# Altium schematic sheet 1_P1.schdoc.schdoc
size 431 x 309 mm; Symbol: Sheet-Symbol_A3; Device: Sheet-Symbol_A3; Company: EasyEDA.com; Drawed: Tejas Gulur; Reviewed: EasyEDA Pro; Version: V0.1; Page Size: A3; @Project Name: ESP32-Project; @Page Count: 1; @Update Date: 2023-02-14; @Create Date: 2022-12-23; @Schematic Name: ESP32-Project; Part Number: JLCPCB-001; @Page No: 1; @Page Name: P1
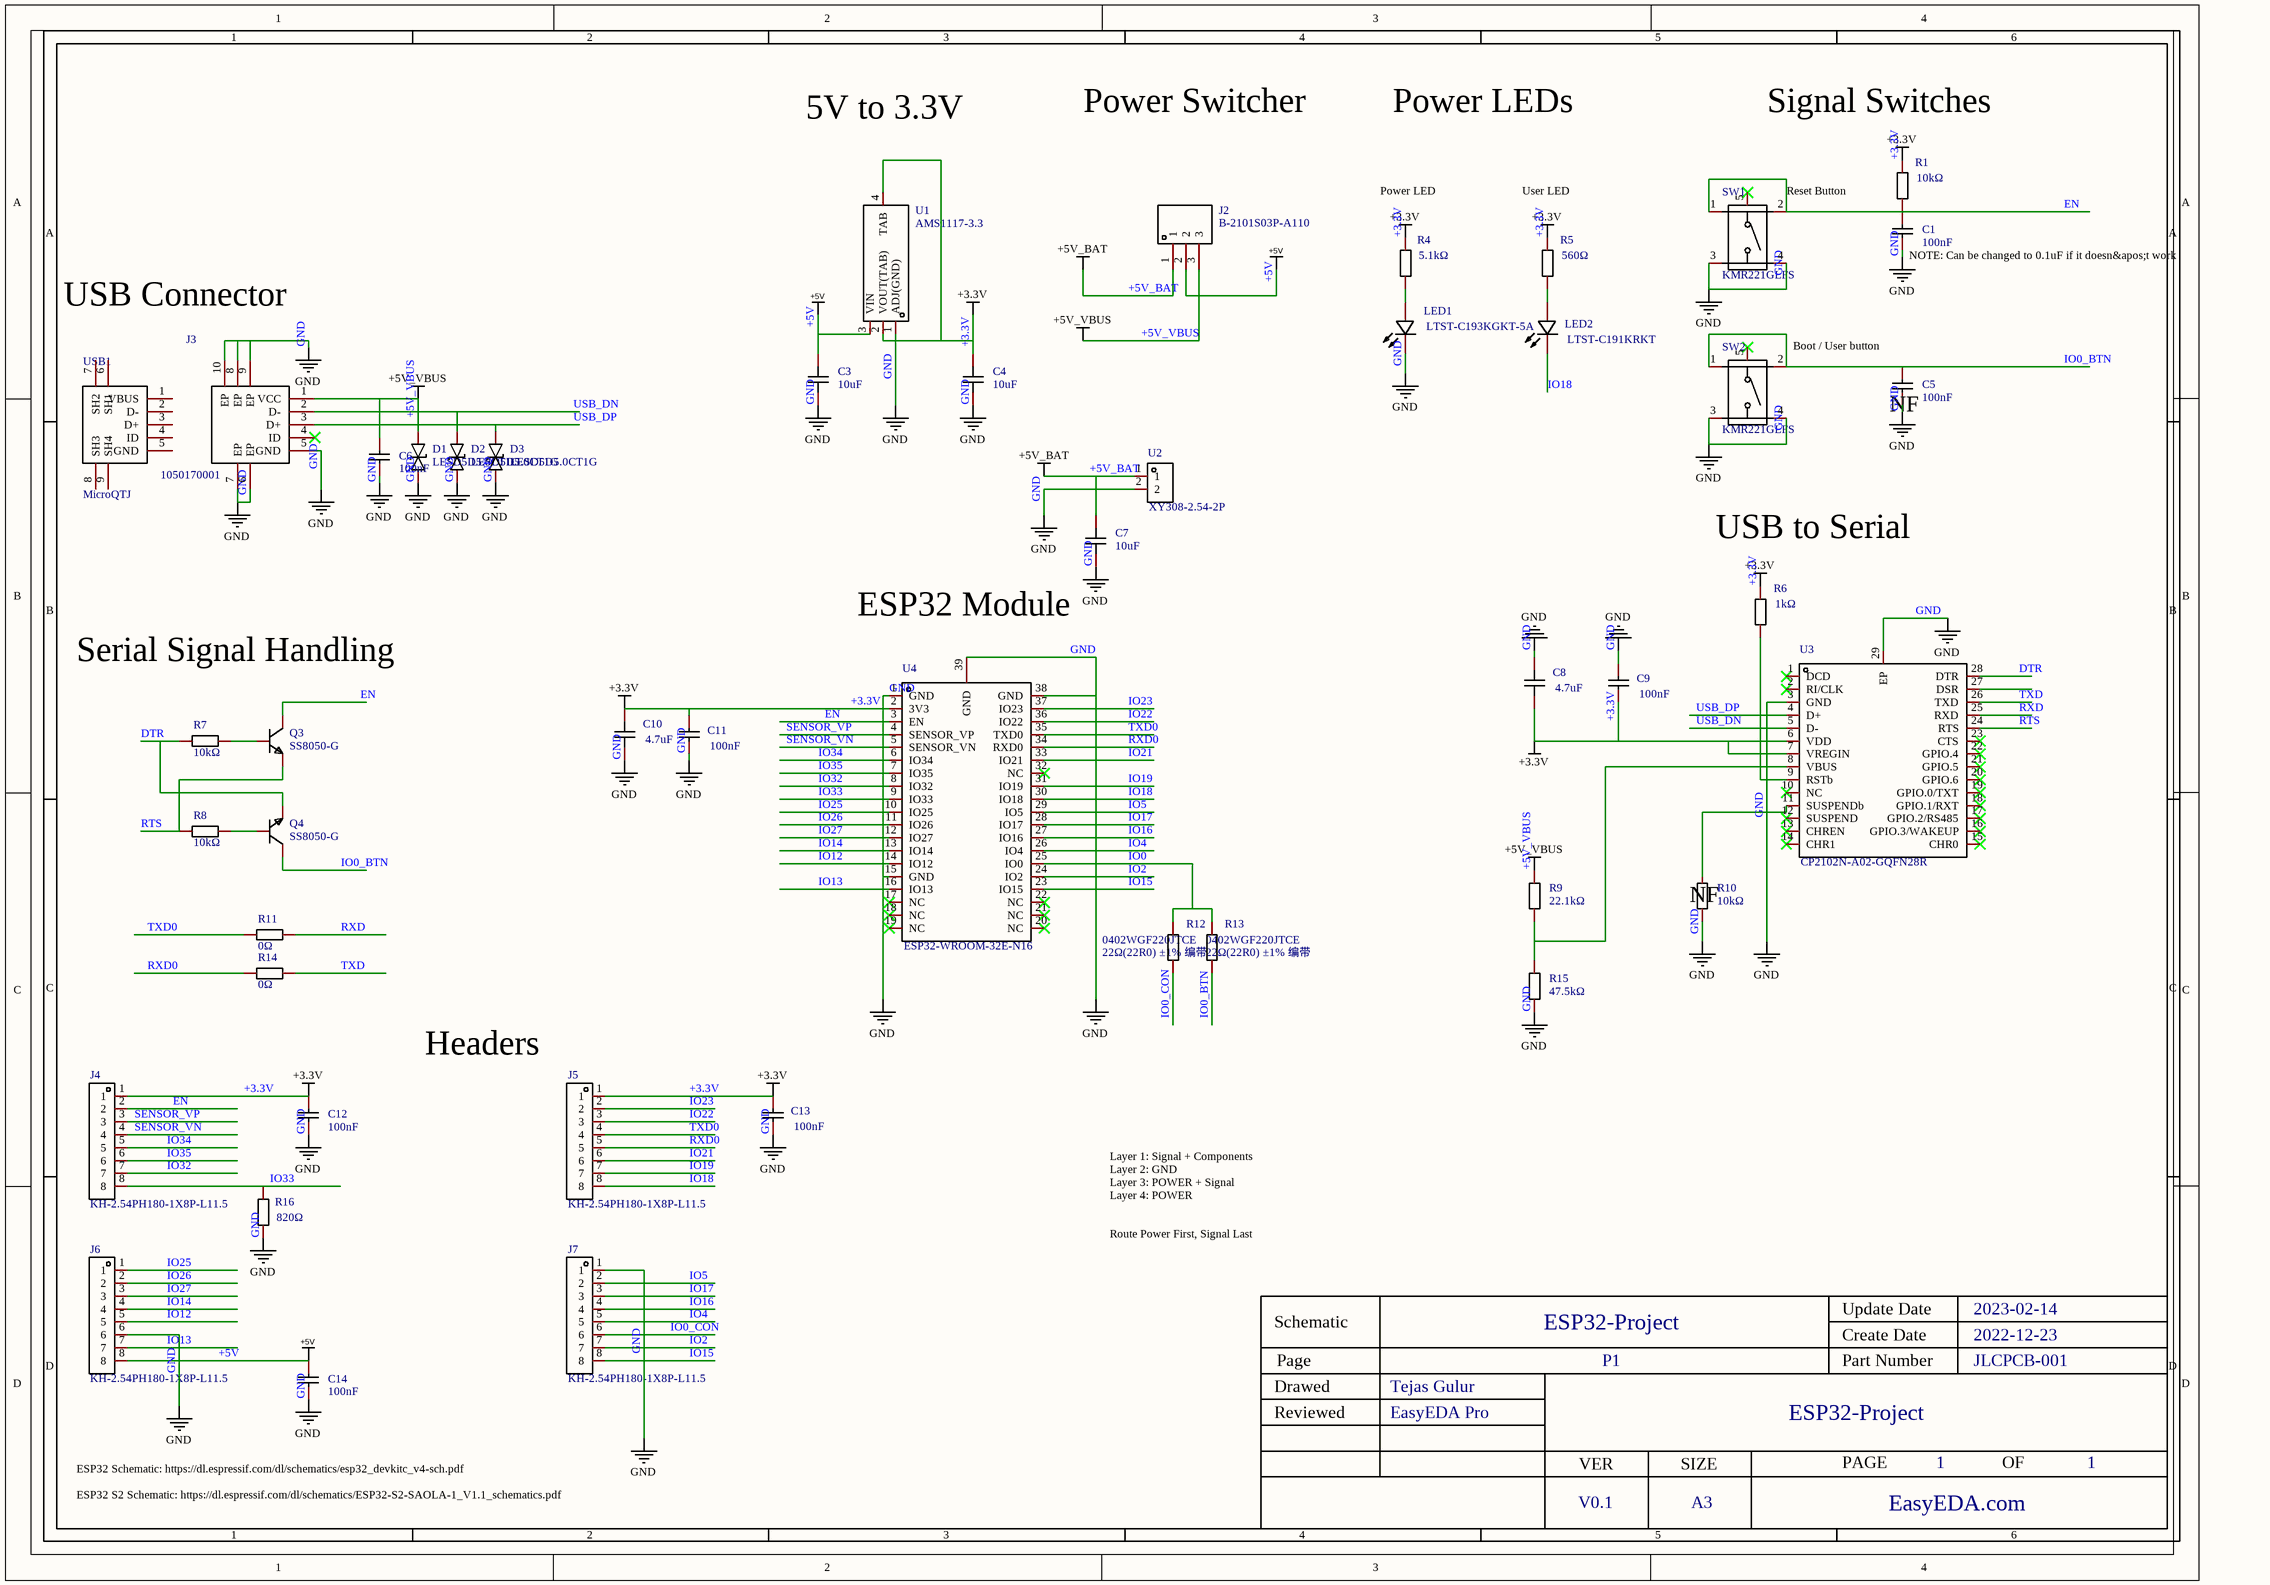
[diagram p0: 1_P1.schdoc.schdoc]

## Parts
C1  100nF  [C0402_NEW]
C3  10uF  [C0402]
C4  10uF  [C0402]
C5  100nF  [C0402_NEW]
C6  100nF  [C0402_NEW]
C7  10uF  [C0402]
C8  4.7uF  [C0402]
C9  100nF  [C0402_NEW]
C10  4.7uF  [C0402]
C11  100nF  [C0402_NEW]
C12  100nF  [C0402_NEW]
C13  100nF  [C0402_NEW]
C14  100nF  [C0402_NEW]
D1  LESD5D5.0CT1G  [SOD-523_L1.2-W0.8-LS1.6-BI]
D2  LESD5D5.0CT1G  [SOD-523_L1.2-W0.8-LS1.6-BI]
D3  LESD5D5.0CT1G  [SOD-523_L1.2-W0.8-LS1.6-BI]
J2  B-2101S03P-A110  [HDR-TH_3P-P1.27-V-M-1]
J3  1050170001  [MICRO-USB-SMD_105017-0001]
J4  KH-2.54PH180-1X8P-L11.5  [HDR-TH_8P-P2.54-V-M]
J5  KH-2.54PH180-1X8P-L11.5  [HDR-TH_8P-P2.54-V-M]
J6  KH-2.54PH180-1X8P-L11.5  [HDR-TH_8P-P2.54-V-M]
J7  KH-2.54PH180-1X8P-L11.5  [HDR-TH_8P-P2.54-V-M]
LED1  LTST-C193KGKT-5A  [LED0603-RD]
LED2  LTST-C191KRKT  [LED0603-RD]
Q3  SS8050-G  [SOT-23-3_L2.9-W1.3-P1.90-LS2.4-BR]
Q4  SS8050-G  [SOT-23-3_L2.9-W1.3-P1.90-LS2.4-BR]
R1  10kΩ  [R0402]
R4  5.1kΩ  [R0402]
R5  560Ω  [R0402]
R6  1kΩ  [R0402]
R7  10kΩ  [R0402]
R8  10kΩ  [R0402]
R9  22.1kΩ  [R0402]
R10  10kΩ  [R0402]
R11  0Ω  [R0402]
R12  LCSC Part Name: 22Ω(22R0) ±1% 编带  [R0402]  (hidden comment: 0402WGF220JTCE)
R13  LCSC Part Name: 22Ω(22R0) ±1% 编带  [R0402]  (hidden comment: 0402WGF220JTCE)
R14  0Ω  [R0402]
R15  47.5kΩ  [R0402]
R16  820Ω  [R0402]
SW1  KMR221GLFS  [KEY-SMD_KMR2XXGXXX]
SW2  KMR221GLFS  [KEY-SMD_KMR2XXGXXX]
U1  AMS1117-3.3  [SOT-223-4_L6.5-W3.5-P2.30-LS7.0-BR]
U2  XY308-2.54-2P  [CONN-TH_XY308-2.54-2P]
U3  CP2102N-A02-GQFN28R  [QFN-28_L5.0-W5.0-P0.50-TL-EP3.3]
U4  ESP32-WROOM-32E-N16  [WIFI-SMD_ESP32-WROOM-32E]
USB1  MicroQTJ  [MICRO-USB-SMD_MICROQTJ]

## Nets
+3.3V: C4.2 C8.1 C9.1 C10.2 C11.2 C12.2 C13.2 J4.1 J5.1 R1.2 R4.2 R5.2 R6.2 U1.2(VOUT(TAB)) U1.4(TAB) U3.6(VDD) U3.7(VREGIN) U4.2(3V3)
+5V: C3.2 C14.2 J2.2 J6.8 U1.3(VIN)
+5V_BAT: C7.2 J2.1 U2.1
+5V_VBUS: C6.2 D1.2 J2.3 J3.1(VCC) R9.1
GND: C1.1 C3.1 C4.1 C5.1 C6.1 C7.1 C8.2 C9.2 C10.1 C11.1 C12.1 C13.1 C14.1 D1.1 D2.1 D3.1 J3.5(GND) J3.6(EP) J3.7(EP) J3.8(EP) J3.9(EP) J3.10(EP) J6.6 J7.1 LED1.1(-) R10.2 R15.1 R16.1 SW1.3 SW1.4 SW2.3 SW2.4 U1.1(ADJ(GND)) U2.2 U3.3(GND) U3.29(EP) U4.1(GND) U4.15(GND) U4.38(GND) U4.39(GND)
DTR: Q4.2(E) R7.1 U3.28(DTR)
EN: C1.2 J4.2 Q3.3(C) R1.1 SW1.1 SW1.2 U4.3(EN)
IO0: R12.2 R13.2 U4.25(IO0)
IO0_BTN: C5.2 Q4.3(C) R13.1 SW2.1 SW2.2
IO0_CON: J7.6 R12.1
IO2: J7.7 U4.24(IO2)
IO4: J7.5 U4.26(IO4)
IO5: J7.2 U4.29(IO5)
IO12: J6.5 U4.14(IO12)
IO13: J6.7 U4.16(IO13)
IO14: J6.4 U4.13(IO14)
IO15: J7.8 U4.23(IO15)
IO16: J7.4 U4.27(IO16)
IO17: J7.3 U4.28(IO17)
IO18: J5.8 LED2.1(-) U4.30(IO18)
IO19: J5.7 U4.31(IO19)
IO21: J5.6 U4.33(IO21)
IO22: J5.3 U4.36(IO22)
IO23: J5.2 U4.37(IO23)
IO25: J6.1 U4.10(IO25)
IO26: J6.2 U4.11(IO26)
IO27: J6.3 U4.12(IO27)
IO32: J4.7 U4.8(IO32)
IO33: J4.8 R16.2 U4.9(IO33)
IO34: J4.5 U4.6(IO34)
IO35: J4.6 U4.7(IO35)
RTS: Q3.2(E) R8.1 U3.24(RTS)
RXD: R11.2 U3.25(RXD)
RXD0: J5.5 R14.1 U4.34(RXD0)
SENSOR_VN: J4.4 U4.5(SENSOR_VN)
SENSOR_VP: J4.3 U4.4(SENSOR_VP)
TXD: R14.2 U3.26(TXD)
TXD0: J5.4 R11.1 U4.35(TXD0)
USB_DN: D2.2 J3.2(D-) U3.5(D-)
USB_DP: D3.2 J3.3(D+) U3.4(D+)
NetLED1_2: LED1.2(+) R4.1
NetLED2_2: LED2.2(+) R5.1
NetQ3_1: Q3.1(B) R7.2
NetQ4_1: Q4.1(B) R8.2
NetR6_1: R6.1 U3.9(RSTb)
NetR9_2: R9.2 R15.2 U3.8(VBUS)
NetR10_1: R10.1 U3.11(SUSPENDb)

Not connected (* = marked no-connect by the designer): J3 4(ID)*; SW1 5*; SW2 5*; U3 1(DCD)* 2(RI/CLK)* 10(NC)* 12(SUSPEND)* 13(CHREN)* 14(CHR1)* 15(CHR0)* 16(GPIO.3/WAKEUP)* 17(GPIO.2/RS485)* 18(GPIO.1/RXT)* 19(GPIO.0/TXT)* 20(GPIO.6)* 21(GPIO.5)* 22(GPIO.4)* 23(CTS)* 27(DSR); U4 17(NC)* 18(NC)* 19(NC)* 20(NC)* 21(NC)* 22(NC)* 32(NC)*; USB1 1(VBUS) 2(D-) 3(D+) 4(ID) 5(GND) 6(SH1) 7(SH2) 8(SH3) 9(SH4)

## Notes on the sheet
- Power Switcher
- Power LEDs
- Signal Switches
- 5V to 3.3V
- Power LED
- User LED
- (near SW1) Reset Button
- USB Connector
- (near C1) NOTE: Can be changed to 0.1uF if it doesn&apos;t work
- Boot / User button
- (near C5) NF
- USB to Serial
- ESP32 Module
- Serial Signal Handling
- (near R10) NF
- Headers
- Layer 1: Signal + Components
  Layer 2: GND
  Layer 3: POWER + Signal
  Layer 4: POWER
  Route Power First, Signal Last
- ESP32 Schematic: https://dl.espressif.com/dl/schematics/esp32_devkitc_v4-sch.pdf
- ESP32 S2 Schematic: https://dl.espressif.com/dl/schematics/ESP32-S2-SAOLA-1_V1.1_schematics.pdf
- 1
- 2
- 3
- 4
- 5
- 6
- A
- B
- C
- Schematic
- ESP32-Project
- Create Date
- Update Date
- 2023-02-14
- 2022-12-23
- D
- Reviewed
- Drawed
- Page
- Tejas Gulur
- EasyEDA Pro
- P1
- Part Number
- JLCPCB-001
- VER
- SIZE
- PAGE
- OF
- V0.1
- A3
- EasyEDA.com

## Library data of the parts
C1 C5 C6 C9 C11-C14 = CL05B104KO5NNNC: Capacitance: Tolerance:±10% Tolerance:±10% Voltage Rated: Temperature Coefficient:; Manufacturer: SAMSUNG(三星); Add into BOM: yes; Tolerance: ±10%; Name: 100nF; Symbol: CL05B104KO5NNNC; Device: CL05B104KO5NNNC; LCSC Part Name: 100nF ±10% 16V; Supplier Part: C1525; Manufacturer Part: CL05B104KO5NNNC; Supplier Footprint: 0402; Datasheet: https://atta.szlcsc.com/upload/public/pdf/source/20160103/1457707674891.pdf; Supplier: LCSC; Convert to PCB: yes; Value: 100nF
  C9 C11 C13: JLCPCB Part Class: Basic Part
C3 C4 C7 = CL05A106MP5NUNC_C315248: Capacitance: Tolerance:±20% Tolerance:±20% Voltage Rated: Temperature Coefficient:; Manufacturer: SAMSUNG(三星); Add into BOM: yes; Tolerance: ±20%; Name: 10uF; Symbol: CL05A106MP5NUNC_C315248; Device: CL05A106MP5NUNC_C315248; LCSC Part Name: 10uF ±20% 10V; Supplier Part: C315248; Manufacturer Part: CL05A106MP5NUNC; Supplier Footprint: 0402; JLCPCB Part Class: Extended Part; Datasheet: https://atta.szlcsc.com/upload/public/pdf/source/20200102/C478861_C4302703595930F3C0E62DAD3349F1AA.pdf; Supplier: LCSC; Convert to PCB: yes; Value: 10uF
C8 C10 = CL05A475KP5NRNC: Capacitance: Tolerance:±10% Tolerance:±10% Voltage Rated: Temperature Coefficient:; Manufacturer: SAMSUNG(三星); Add into BOM: yes; Tolerance: ±10%; Name: 4.7uF; Symbol: CL05A475KP5NRNC; Device: CL05A475KP5NRNC; LCSC Part Name: 4.7uF ±10% 10V; Supplier Part: C368809; Manufacturer Part: CL05A475KP5NRNC; Supplier Footprint: 0402; JLCPCB Part Class: Extended Part; Datasheet: https://atta.szlcsc.com/upload/public/pdf/source/20190214/C368809_F5BC89A17870A6A4D09EEE17ED063906.pdf; Supplier: LCSC; Convert to PCB: yes; Value: 4.7uF
D1-D3 = LESD5D5.0CT1G: Polarity:Bi-Directional Reverse Stand-Off Voltage (Vrwm):5V Breakdown Voltage (VBR):5.6V Peak Pulse Current(Ipp)@8/20us:9.4A Clamping Voltage@Ipp:18.6V; Manufacturer: LRC(乐山无线电); Add into BOM: yes; Reverse Stand-Off Voltage (Vrwm): 5V; Breakdown Voltage (VBR): 5.6V; Peak Pulse Current(Ipp)@8/20us: 9.4A; Clamping Voltage@Ipp: 18.6V; Name: LESD5D5.0CT1G; Symbol: LESD5D5.0CT1G; Device: LESD5D5.0CT1G; LCSC Part Name: LESD5D5.0CT1G; Supplier Part: C383211; Manufacturer Part: LESD5D5.0CT1G; Supplier Footprint: SOD-523; JLCPCB Part Class: Extended Part; Datasheet: https://atta.szlcsc.com/upload/public/pdf/source/20190807/C383211_633DF4B4E2C161403226E5235FE33A1C.pdf; Supplier: LCSC; Convert to PCB: yes; Polarity: Bi-Directional
J2 = B-2101S03P-A110: Number of Rows:单排 Number of Pins:3 Pitch:1.27mm Pin Structure:1x3P Row Spacing:- Mounting Type:Straight Circluar Pins/Square Pins:- Current Rating (Max):- Voltage Rating (Max):- Length of Mating Pin:3mm Insulation Height:1mm Length of End Connection Pin:1; Manufacturer: Ckmtw(灿科盟); Symbol: 210-1S-1*3Ppin Gold-plated; Add into BOM: yes; Pitch: 1.27mm; Pin Structure: 1x3P; Name: B-2101S03P-A110; Device: B-2101S03P-A110; LCSC Part Name: 1.27mm 1x3P 直插; Supplier Part: C124354; Manufacturer Part: B-2101S03P-A110; Supplier Footprint: 插件,P=1.27mm; Datasheet: https://atta.szlcsc.com/upload/public/pdf/source/20170821/C124354_1503303295848901506.pdf; Supplier: LCSC; Convert to PCB: yes; Number of Rows: 单排; Number of Pins: 3; Row Spacing: -; Mounting Type: Straight; Circluar Pins/Square Pins: -; Current Rating (Max): -; Voltage Rating (Max): -; Length of Mating Pin: 3mm; Insulation Height: 1mm; Length of End Connection Pin: 1.8mm; Contact Plating: -; Operating Temperature Range: -40~+105; Color: Black
J3 = 1050170001: Connector Type:Micro-B Standard:USB 2.0 Gender:Female Number of Contacts:5 Number of Ports:1 Mounting Style:Surface Mount Current Rating - Power (Max):- Operating Temperature Range:- Operating Temperature Range:-; Manufacturer: MOLEX; Symbol: 105017-0001; Add into BOM: yes; Gender: Female; Number of Contacts: 5; Number of Ports: 1; Name: 1050170001; Device: 1050170001; LCSC Part Name: Micro-B 母座 卧贴; Supplier Part: C136000; Manufacturer Part: 1050170001; Supplier Footprint: SMD; Datasheet: https://atta.szlcsc.com/upload/public/pdf/source/20171113/C136000_15105610884381115465.pdf; Supplier: LCSC; Convert to PCB: yes; Connector Type: Micro-B; Standard: USB 2.0; Mounting Style: Surface Mount; Current Rating - Power (Max): -; Operating Temperature Range: -
J4-J7 = KH-2.54PH180-1X8P-L11.5: Number of Rows:单排 Number of Pins:8 Pitch:2.54mm Pin Structure:1x8P Row Spacing:- Mounting Type:Straight Circluar Pins/Square Pins:Square Pins Current Rating (Max):3A Voltage Rating (Max):- Length of Mating Pin:6mm Insulation Height:2.5mm Length of End Con; Manufacturer: kinghelm(金航标); Add into BOM: yes; Pitch: 2.54mm; Pin Structure: 1x8P; Current Rating (Max): 3A; Name: KH-2.54PH180-1X8P-L11.5; Symbol: KH-2.54PH180-1X8P-L11.5; Device: KH-2.54PH180-1X8P-L11.5; LCSC Part Name: 2.54mm 1x8P 直插 方针; Supplier Part: C2905487; Manufacturer Part: KH-2.54PH180-1X8P-L11.5; Supplier Footprint: 插件,P=2.54mm; JLCPCB Part Class: Extended Part; Datasheet: https://atta.szlcsc.com/upload/public/pdf/source/20211019/E207DA256892DEA6FC546F48FC628120.pdf; Supplier: LCSC; Convert to PCB: yes; Number of Rows: 单排; Number of Pins: 8; Row Spacing: -; Mounting Type: Straight; Circluar Pins/Square Pins: Square Pins; Voltage Rating (Max): -; Length of Mating Pin: 6mm; Insulation Height: 2.5mm; Length of End Connection Pin: 3mm; Operating Temperature Range: -40~+105; Color: Black
LED1 = LTST-C193KGKT-5A: Emitted Color:普绿/Yellow-Green Diode Configuration:- Lens Color:Colorless transparence Dominant Wavelength:567.5nm~576.5nm Dominant Wavelength:567.5nm~576.5nm Peak Wavelength:574nm Color Temperature:- Color Temperature:- Forward Current:5mA Power Dissipati; Manufacturer: LITEON(光宝); Add into BOM: yes; Peak Wavelength: 574nm; Forward Current: 5mA; Power Dissipation: 75mW; Viewing Angle: 130°; Name: LTST-C193KGKT-5A; Symbol: LTST-C193KGKT-5A; Device: LTST-C193KGKT-5A; LCSC Part Name: 普绿/黄绿 567.5nm~576.5nm; Supplier Part: C125102; Manufacturer Part: LTST-C193KGKT-5A; Supplier Footprint: 0603; JLCPCB Part Class: Extended Part; Datasheet: https://atta.szlcsc.com/upload/public/pdf/source/20171230/C125102_15146280488131222052.PDF; Supplier: LCSC; Convert to PCB: yes; Emitted Color: 普绿/Yellow-Green; Diode Configuration: -; Lens Color: Colorless transparence; Dominant Wavelength: 567.5nm~576.5nm; Color Temperature: -; Mounting Sytle: -; Operating Temperature: -55~+85
LED2 = LTST-C191KRKT: Emitted Color:红灯 Diode Configuration:- Lens Color:Colorless transparence Dominant Wavelength:631nm~631nm Dominant Wavelength:631nm~631nm Peak Wavelength:639nm Color Temperature:- Color Temperature:- Forward Current:20mA Power Dissipation:75mW Viewing Angl; Manufacturer: LITEON(光宝); Add into BOM: yes; Emitted Color: 红灯; Peak Wavelength: 639nm; Forward Current: 20mA; Power Dissipation: 75mW; Viewing Angle: 130°; Name: LTST-C191KRKT; Symbol: LTST-C191KRKT; Device: LTST-C191KRKT; LCSC Part Name: 红灯 631nm; Supplier Part: C125099; Manufacturer Part: LTST-C191KRKT; Supplier Footprint: 0603; JLCPCB Part Class: Extended Part; Datasheet: https://atta.szlcsc.com/upload/public/pdf/source/20180129/C125099_15171878294931315872.pdf; Supplier: LCSC; Convert to PCB: yes; Diode Configuration: -; Lens Color: Colorless transparence; Dominant Wavelength: 631nm~631nm; Color Temperature: -; Mounting Sytle: -; Operating Temperature: -55℃~+85℃
Q3 Q4 = SS8050-G: Transistor Type: Collector-Emitter Breakdown Voltage (Vceo): Collector Current (Ic): Power Dissipation (Pd): Collector Cut-Off Current (Icbo):100nA Collector-Emitter Saturation Voltage (VCE(sat)@Ic,Ib):500mV@800mA,80mA DC Current Gain (hFE@Ic,Vce):200@100; Manufacturer: CJ(江苏长电/长晶); Symbol: SS8050-G_C164885; Add into BOM: yes; Collector Cut-Off Current (Icbo): 100nA; DC Current Gain (hFE@Ic,Vce): 200@100mA,1V; Transition Frequency (fT): 100MHz; Name: SS8050-G; Device: SS8050-G; LCSC Part Name: NPN 25V 1.5A; Supplier Part: C164885; Manufacturer Part: SS8050-G; Supplier Footprint: SOT-23-3; JLCPCB Part Class: Extended Part; Datasheet: https://atta.szlcsc.com/upload/public/pdf/source/20171228/C164885_15144412871481213889.pdf; Supplier: LCSC; Convert to PCB: yes; Collector-Emitter Saturation Voltage (VCE(sat)@Ic,Ib): 500mV@800mA,80mA; Operating Temperature: +150@(Tj)
R1 R7 R8 R10 = 0402WGF1002TCE: Type:Thick Film Resistors Resistance: Tolerance:±1% Tolerance:±1% Power(Watts): Temperature Coefficient:±100ppm/ Temperature Coefficient:±100ppm/ Overload Voltage (Max): Operating Temperature Range:-55~+155 Operating Temperature Range:-55~+155; Manufacturer: UNI-ROYAL(厚声); Add into BOM: yes; Tolerance: ±1%; Name: 10kΩ; Symbol: 0402WGF1002TCE; Device: 0402WGF1002TCE; LCSC Part Name: 10kΩ ±1% 62.5mW; Supplier Part: C25744; Manufacturer Part: 0402WGF1002TCE; Supplier Footprint: 0402; Datasheet: https://atta.szlcsc.com/upload/public/pdf/source/20200306/C422600_1E6D84923E4A46A82E41ADD87F860B5C.pdf; Supplier: LCSC; Convert to PCB: yes; Type: Thick Film Resistors; Value: 10kΩ; Temperature Coefficient: ±100ppm/; Operating Temperature Range: -55~+155
R4 = 0402WGJ0512TCE: Type:Thick Film Resistors Resistance: Tolerance:±5% Tolerance:±5% Power(Watts): Temperature Coefficient:±100ppm/ Temperature Coefficient:±100ppm/ Overload Voltage (Max): Operating Temperature Range:-55~+155 Operating Temperature Range:-55~+155; Manufacturer: UNI-ROYAL(厚声); Add into BOM: yes; Tolerance: ±5%; Name: 5.1kΩ; Symbol: 0402WGJ0512TCE; Device: 0402WGJ0512TCE; LCSC Part Name: 5.1kΩ ±5% 62.5mW; Supplier Part: C25941; Manufacturer Part: 0402WGJ0512TCE; Supplier Footprint: 0402; JLCPCB Part Class: Extended Part; Datasheet: https://atta.szlcsc.com/upload/public/pdf/source/20200306/C422600_1E6D84923E4A46A82E41ADD87F860B5C.pdf; Supplier: LCSC; Convert to PCB: yes; Type: Thick Film Resistors; Value: 5.1kΩ; Temperature Coefficient: ±100ppm/; Operating Temperature Range: -55~+155
R5 = 0402WGJ0561TCE: Type:Thick Film Resistors Resistance: Tolerance:±5% Tolerance:±5% Power(Watts): Temperature Coefficient:±100ppm/ Temperature Coefficient:±100ppm/ Overload Voltage (Max): Operating Temperature Range:-55~+155 Operating Temperature Range:-55~+155; Manufacturer: UNI-ROYAL(厚声); Add into BOM: yes; Tolerance: ±5%; Name: 560Ω; Symbol: 0402WGJ0561TCE; Device: 0402WGJ0561TCE; LCSC Part Name: 560Ω ±5% 62.5mW; Supplier Part: C25172; Manufacturer Part: 0402WGJ0561TCE; Supplier Footprint: 0402; JLCPCB Part Class: Extended Part; Datasheet: https://atta.szlcsc.com/upload/public/pdf/source/20200306/C422600_1E6D84923E4A46A82E41ADD87F860B5C.pdf; Supplier: LCSC; Convert to PCB: yes; Type: Thick Film Resistors; Value: 560Ω; Temperature Coefficient: ±100ppm/; Operating Temperature Range: -55~+155
R6 = 0402WGF1001TCE: Type:Thick Film Resistors Resistance: Tolerance:±1% Tolerance:±1% Power(Watts): Temperature Coefficient:±100ppm/ Temperature Coefficient:±100ppm/ Overload Voltage (Max): Operating Temperature Range:-55~+155 Operating Temperature Range:-55~+155; Manufacturer: UNI-ROYAL(厚声); Add into BOM: yes; Tolerance: ±1%; Name: 1kΩ; Symbol: 0402WGF1001TCE; Device: 0402WGF1001TCE; LCSC Part Name: 1kΩ ±1% 62.5mW; Supplier Part: C11702; Manufacturer Part: 0402WGF1001TCE; Supplier Footprint: 0402; Datasheet: https://atta.szlcsc.com/upload/public/pdf/source/20200306/C422600_1E6D84923E4A46A82E41ADD87F860B5C.pdf; Supplier: LCSC; Convert to PCB: yes; Type: Thick Film Resistors; Value: 1kΩ; Temperature Coefficient: ±100ppm/; Operating Temperature Range: -55~+155
R9 = 0402WGF2212TCE: Type:Thick Film Resistors Resistance: Tolerance:±1% Tolerance:±1% Power(Watts): Temperature Coefficient:±100ppm/ Temperature Coefficient:±100ppm/ Overload Voltage (Max): Operating Temperature Range:-55~+155 Operating Temperature Range:-55~+155; Manufacturer: UNI-ROYAL(厚声); Add into BOM: yes; Tolerance: ±1%; Name: 22.1kΩ; Symbol: 0402WGF2212TCE; Device: 0402WGF2212TCE; LCSC Part Name: 22.1kΩ ±1% 62.5mW; Supplier Part: C43473; Manufacturer Part: 0402WGF2212TCE; Supplier Footprint: 0402; Datasheet: https://atta.szlcsc.com/upload/public/pdf/source/20200306/C422600_1E6D84923E4A46A82E41ADD87F860B5C.pdf; Supplier: LCSC; Convert to PCB: yes; Type: Thick Film Resistors; Value: 22.1kΩ; Temperature Coefficient: ±100ppm/; Operating Temperature Range: -55~+155
R11 R14 = 0402WGF0000TCE: Type:Thick Film Resistors Resistance: Tolerance:±1% Tolerance:±1% Power(Watts): Temperature Coefficient:±800ppm/ Temperature Coefficient:±800ppm/ Overload Voltage (Max): Operating Temperature Range:-55~+155 Operating Temperature Range:-55~+155; Manufacturer: UNI-ROYAL(厚声); Add into BOM: yes; Tolerance: ±1%; Name: 0Ω; Symbol: 0402WGF0000TCE; Device: 0402WGF0000TCE; LCSC Part Name: 0Ω ±1% 62.5mW; Supplier Part: C17168; Manufacturer Part: 0402WGF0000TCE; Supplier Footprint: 0402; Datasheet: https://atta.szlcsc.com/upload/public/pdf/source/20200306/C422600_1E6D84923E4A46A82E41ADD87F860B5C.pdf; Supplier: LCSC; Convert to PCB: yes; Type: Thick Film Resistors; Value: 0Ω; Temperature Coefficient: ±800ppm/; Operating Temperature Range: -55~+155
R12 R13 = 0402WGF220JTCE: Manufacturer: UNI-ROYAL(厚声); Add into BOM: yes; Name: 0402WGF220JTCE; Symbol: 0402WGF220JTCE; Device: 0402WGF220JTCE; Supplier Part: C25092; Manufacturer Part: 0402WGF220JTCE; Supplier Footprint: 0402; JLCPCB Part Class: Basic Part; Datasheet: https://atta.szlcsc.com/upload/public/pdf/source/20170920/C25092_1505901206069982723.pdf; Supplier: LCSC; Convert to PCB: yes
R15 = 0402WGF4752TCE: Type:Thick Film Resistors Resistance: Tolerance:±1% Tolerance:±1% Power(Watts): Temperature Coefficient:±100ppm/ Temperature Coefficient:±100ppm/ Overload Voltage (Max): Operating Temperature Range:-55~+155 Operating Temperature Range:-55~+155; Manufacturer: UNI-ROYAL(厚声); Add into BOM: yes; Tolerance: ±1%; Name: 47.5kΩ; Symbol: 0402WGF4752TCE; Device: 0402WGF4752TCE; LCSC Part Name: 47.5kΩ ±1% 62.5mW; Supplier Part: C25896; Manufacturer Part: 0402WGF4752TCE; Supplier Footprint: 0402; Datasheet: https://atta.szlcsc.com/upload/public/pdf/source/20200306/C422600_1E6D84923E4A46A82E41ADD87F860B5C.pdf; Supplier: LCSC; Convert to PCB: yes; Type: Thick Film Resistors; Value: 47.5kΩ; Temperature Coefficient: ±100ppm/; Operating Temperature Range: -55~+155
R16 = 0402WGF8200TCE: Type:Thick Film Resistors Resistance: Tolerance:±1% Tolerance:±1% Power(Watts): Temperature Coefficient:±100ppm/℃ Temperature Coefficient:±100ppm/℃ Overload Voltage (Max): Operating Temperature Range:-55℃~+155℃ Operating Temperature Range:-55℃~+155℃; Manufacturer: UNI-ROYAL(厚声); Add into BOM: yes; Tolerance: ±1%; Name: 820Ω; Symbol: 0402WGF8200TCE; Device: 0402WGF8200TCE; LCSC Part Name: 820Ω ±1% 62.5mW; Supplier Part: C25135; Manufacturer Part: 0402WGF8200TCE; Supplier Footprint: 0402; Datasheet: https://atta.szlcsc.com/upload/public/pdf/source/20200306/C422600_1E6D84923E4A46A82E41ADD87F860B5C.pdf; Supplier: LCSC; Convert to PCB: yes; Type: Thick Film Resistors; Value: 820Ω; Temperature Coefficient: ±100ppm/℃; Operating Temperature Range: -55℃~+155℃
SW1 SW2 = KMR221GLFS: Contact Current:50mA Voltage Rating (DC):32V Circuit:SPST Mounting Style:Brick nogging Actuator Style:Round Button With Lamp:- Switch Length:4.6mm Switch Width:2.8mm Switch Height:1.9mm; Manufacturer: C&K; Add into BOM: yes; Contact Current: 50mA; Voltage Rating (DC): 32V; Circuit: SPST; Switch Length: 4.6mm; Switch Width: 2.8mm; Switch Height: 1.9mm; Name: KMR221GLFS; Symbol: KMR221GLFS; Device: KMR221GLFS; LCSC Part Name: KMR221GLFS; Supplier Part: C72443; Manufacturer Part: KMR221GLFS; Supplier Footprint: SMD; JLCPCB Part Class: Extended Part; Datasheet: https://atta.szlcsc.com/upload/public/pdf/source/20180724/C72443_10CDA5CD4A603EA5CF14C9F04498E715.pdf; Supplier: LCSC; Convert to PCB: yes; Mounting Style: Brick nogging; Actuator Style: Round Button; With Lamp: -
U1 = AMS1117-3.3_C347222: Output Type: Output Polarity:Positive Number of Outputs:1 Maximum Input Voltage:18V Output Voltage:3.3V~3.3V Output Voltage:3.3V~3.3V Dropout Voltage:1.3V@(1A) Output Current:1A Power Supply Rejection Ratio (PSRR):60dB@(120Hz); Manufacturer: UMW(广东友台半导体); Add into BOM: yes; Number of Outputs: 1; Maximum Input Voltage: 18V; Name: AMS1117-3.3; Symbol: AMS1117-3.3_C347222; Device: AMS1117-3.3_C347222; LCSC Part Name: 正 Vin=18V Vout=3.3V 1A 60dB@(120Hz); Supplier Part: C347222; Manufacturer Part: AMS1117-3.3; Supplier Footprint: SOT-223-4; JLCPCB Part Class: Extended Part; Datasheet: https://atta.szlcsc.com/upload/public/pdf/source/20211011/50CC665C22E3A66C08379A4A74BDA25C.pdf; Supplier: LCSC; Convert to PCB: yes; Output Polarity: Positive; Output Voltage: 3.3V~3.3V; Dropout Voltage: 1.3V@(1A); Output Current: 1A; Power Supply Rejection Ratio (PSRR): 60dB@(120Hz)
U2 = XY308-2.54-2P: Pitch:2.54mm Number of Rows:1 Number of PINs Per Row:2 Mounting Style:直针 Current Rating (Max):6A Voltage Rating (Max):150V Wire Gauge - AWG:18~26 Wire Gauge - mm?:1 Operating Temperature Range:- Operating Temperature Range:- Color:Green; Manufacturer: XINLAIYA(新莱亚); Add into BOM: yes; Pitch: 2.54mm; Number of PINs Per Row: 2; Current Rating (Max): 6A; Voltage Rating (Max): 150V; Wire Gauge - AWG: 18~26; Wire Gauge - mm?: 1; Name: XY308-2.54-2P; Symbol: XY308-2.54-2P; Device: XY308-2.54-2P; LCSC Part Name: 2.54mm 排数:1 每排P数:2 直针 升降块式 PA66 铜镀锡; Supplier Part: C557685; Manufacturer Part: XY308-2.54-2P; Supplier Footprint: 直插,P=2.54mm; JLCPCB Part Class: Extended Part; Datasheet: https://atta.szlcsc.com/upload/public/pdf/source/20200527/C557686_13715264167F455C722D771DE12648FD.pdf; Supplier: LCSC; Convert to PCB: yes; Number of Rows: 1; Mounting Style: 直针; Operating Temperature Range: -; Color: Green
U3 = CP2102N-A02-GQFN28R: Type: Protocol: Number of Drivers/Receivers: Data Rate: Supply Voltage:; Manufacturer: SILICON LABS(芯科); Add into BOM: yes; Name: CP2102N-A02-GQFN28R; Symbol: CP2102N-A02-GQFN28R; Device: CP2102N-A02-GQFN28R; LCSC Part Name: CP2102N-A02-GQFN28R; Supplier Part: C964632; Manufacturer Part: CP2102N-A02-GQFN28R; Supplier Footprint: QFN-28; Datasheet: https://atta.szlcsc.com/upload/public/pdf/source/20201204/C964632_F2B790CC23A72455AEF523510305B30A.pdf; Supplier: LCSC; Convert to PCB: yes
U4 = ESP32-WROOM-32E-N16_C701343: Manufacturer: ESPRESSIF(乐鑫); Symbol: ESP32-WROOM-32E(16MB); Add into BOM: yes; Name: ESP32-WROOM-32E-N16; Device: ESP32-WROOM-32E-N16_C701343; LCSC Part Name: WIFI模块; Supplier Part: C701343; Manufacturer Part: ESP32-WROOM-32E-N16; Supplier Footprint: SMD-38P,18x25.5x3.1mm; Datasheet: https://atta.szlcsc.com/upload/public/pdf/source/20200730/C701341_95E089979D39CD8D2471FDC7C7AF29A1.pdf; Supplier: LCSC; Convert to PCB: yes
USB1 = MicroQTJ: Connector Type:Micro-B Standard:USB 2.0 Gender:Female Number of Contacts:5 Number of Ports:1 Mounting Style:Surface Mount Current Rating - Power (Max):- Operating Temperature Range:-30℃~+80℃ Operating Temperature Range:-30℃~+80℃; Manufacturer: SHOU HAN(首韩); Add into BOM: yes; Gender: Female; Number of Contacts: 5; Number of Ports: 1; Name: MicroQTJ; Symbol: MICROQTJ; Device: MicroQTJ; LCSC Part Name: Micro-B 母座 卧贴 有柱; Supplier Part: C404968; Manufacturer Part: MicroQTJ; Supplier Footprint: SMD; JLCPCB Part Class: Extended Part; Datasheet: https://atta.szlcsc.com/upload/public/pdf/source/20191210/C404968_B20FD489995C34B84F95A25A4974802C.pdf; Supplier: LCSC; Convert to PCB: yes; Connector Type: Micro-B; Standard: USB 2.0; Mounting Style: Surface Mount; Current Rating - Power (Max): -; Operating Temperature Range: -30℃~+80℃